# EasyEDA Pro project easyServo_easyEDA_PRO.epro

# Schematic Schematic3
Board Name: Board3; Create Date: 2025-09-12; Page Name: P1; Project Name: projeto2; Schematic Name: Schematic3; Update Date: 2025-10-06; Company: Bagre Corporation; Page Size: A4; Version: V1.0
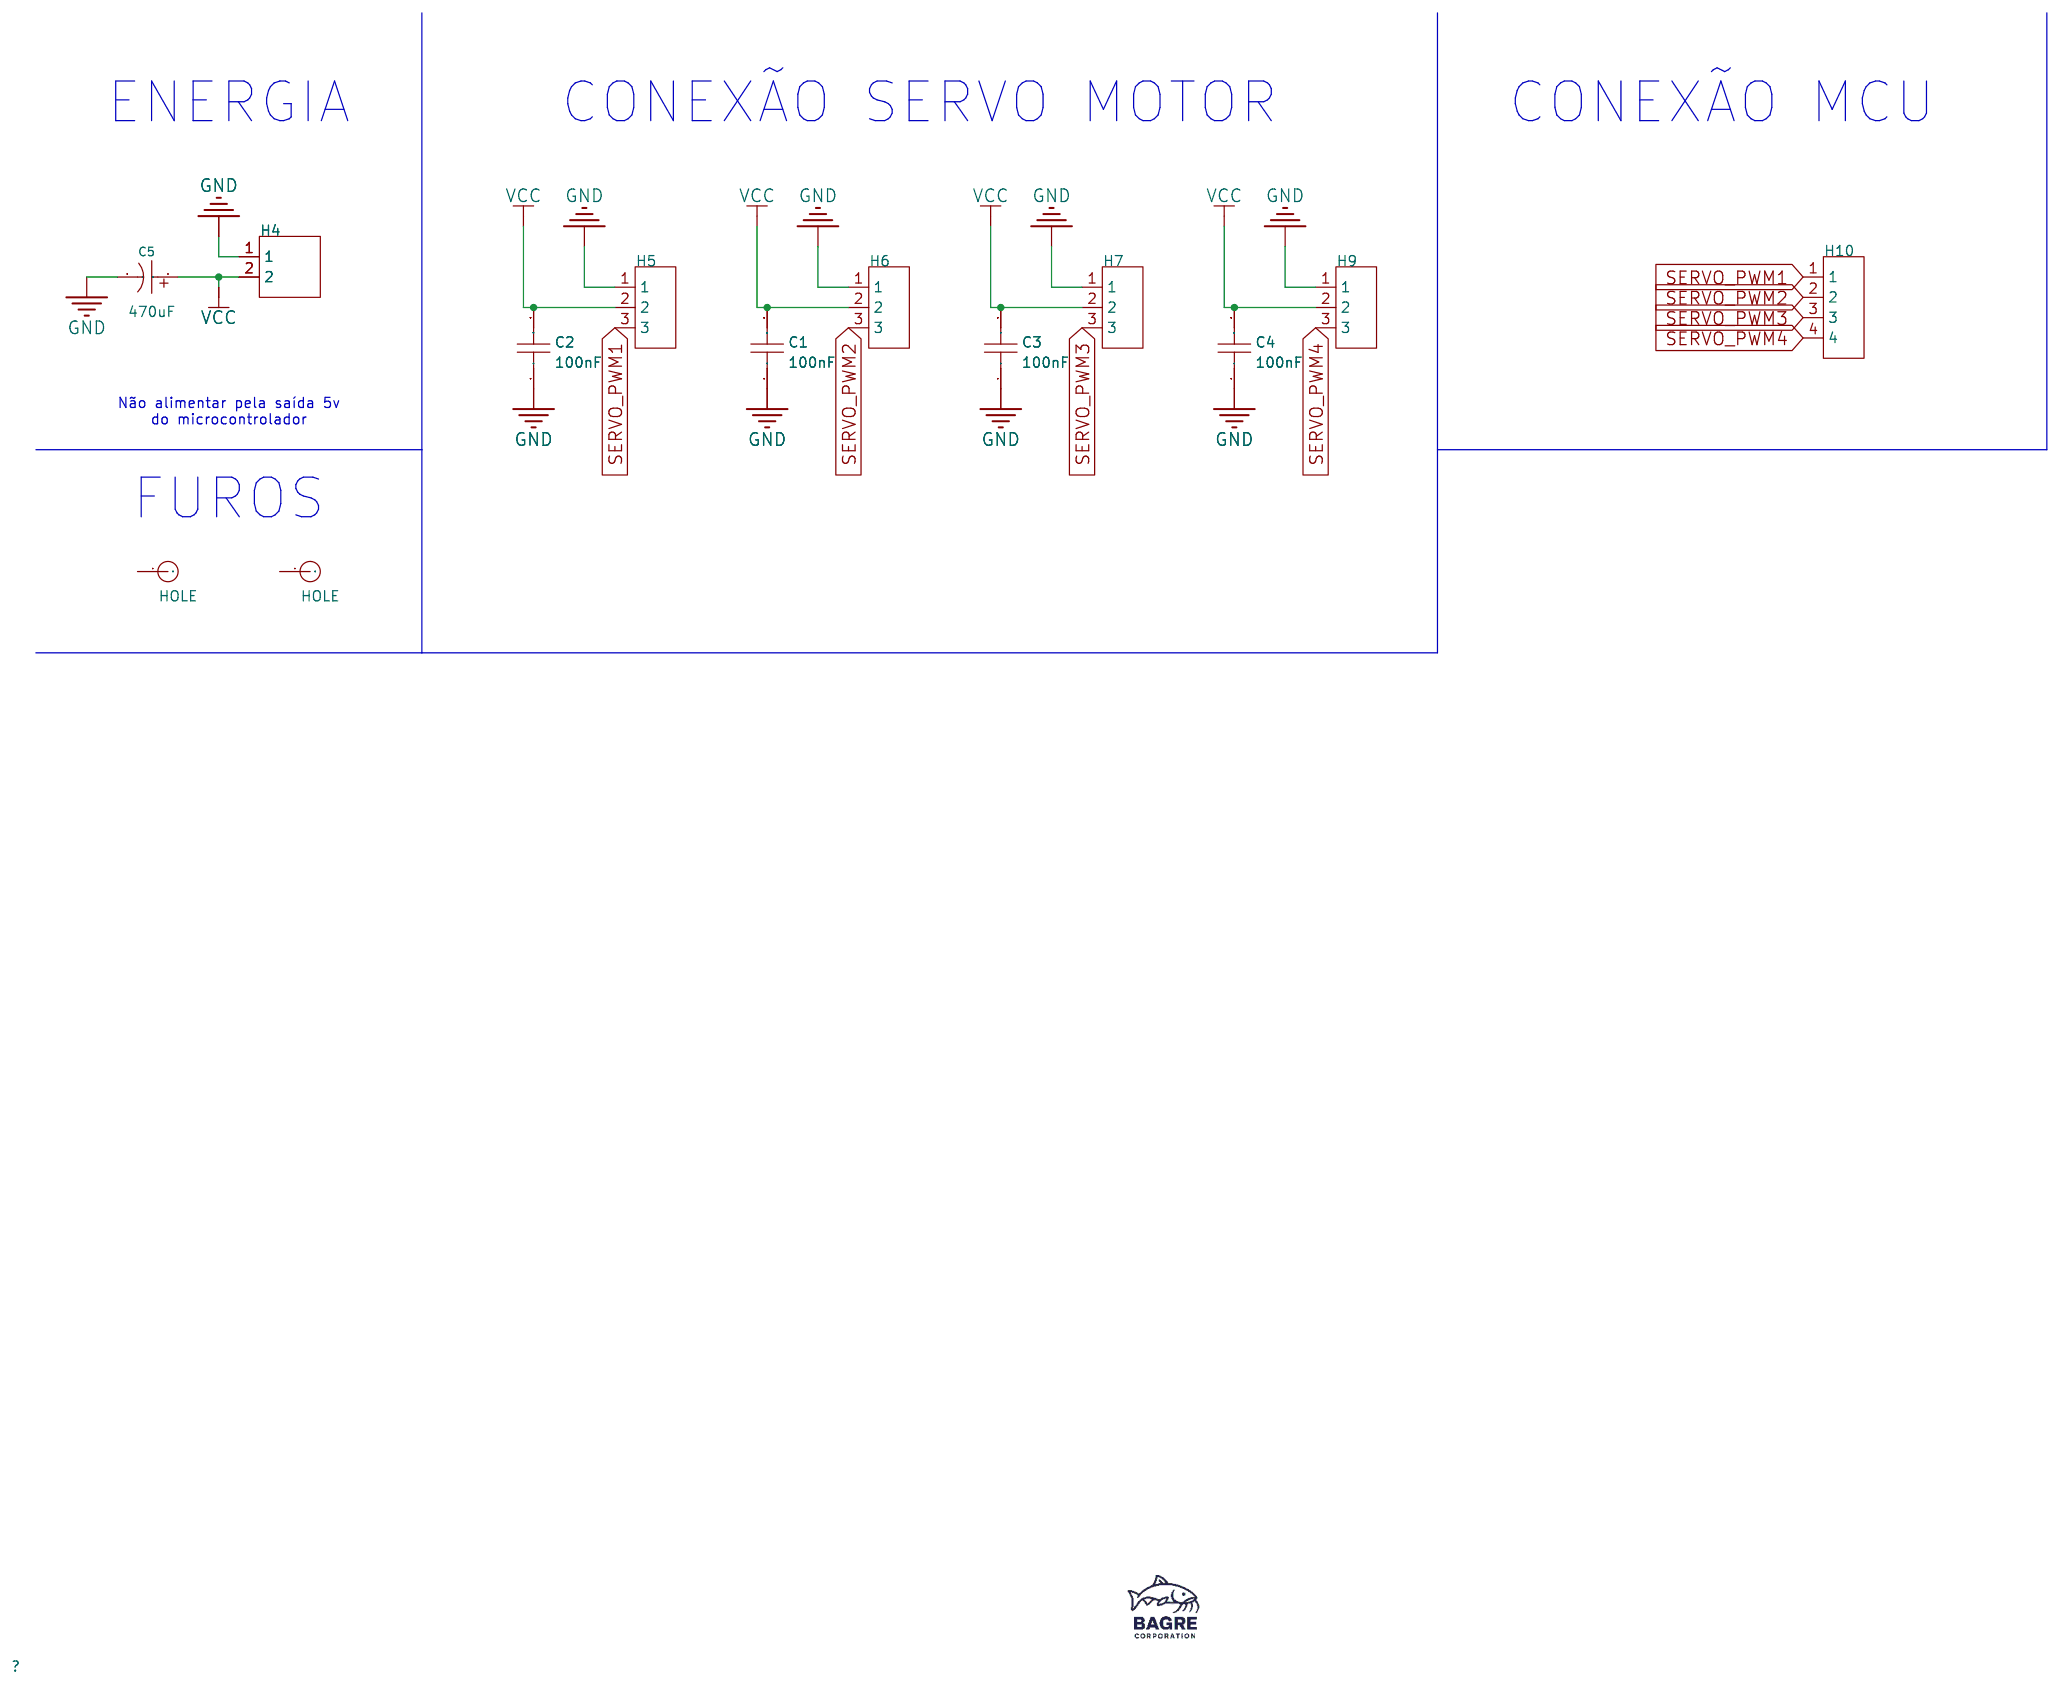
[diagram p0: schematic sheet]

## Parts
C1  100nF  [C1206]
C2  100nF  [C1206]
C3  100nF  [C1206]
C4  100nF  [C1206]
C5  470uF  [CAP-TH_BD6.3-P2.50-D1.0-FD]
H4  -  [HDR-TH_2P-P2.54-V-M-1]
H5  -  [HDR-TH_3P-P2.54-V-M]
H6  -  [HDR-TH_3P-P2.54-V-M]
H7  -  [HDR-TH_3P-P2.54-V-M]
H9  -  [HDR-TH_3P-P2.54-V-M]
H10  -  [HDR-TH_4P-P2.54-V-M]
J1  HOLE  [M2 Mounting Hole - Conductive]
J2  HOLE  [M2 Mounting Hole - Conductive]

## Library data of the parts
C1-C4 = CGJ5L3X7R2D104K160AA: Capacitance: Tolerance:±10% Tolerance:±10% Voltage Rated: Temperature Coefficient:; LCSC Part Name: 100nF ±10% 200V; Supplier Part: C3883443; Manufacturer: TDK; Supplier Footprint: 1206; JLCPCB Part Class: Extended Part; Datasheet: https://atta.szlcsc.com/upload/public/pdf/source/20200407/C508866_6C2FBB2ED8803457DDD31F7C87FB92E8.pdf; Supplier: LCSC; Tolerance: ±10%
C5 = ERR1CM471E14OT: Capacitance: Tolerance:±20% Tolerance:±20% Rated Voltage: Lead Spacing: φD: L: Lifetime @ Temp:2000hrs@105℃; LCSC Part Name: 470uF ±20% 16V; Supplier Part: C106619; Manufacturer: AISHI(艾华集团); Supplier Footprint: 插件,D6.3xL14mm; JLCPCB Part Class: Extended Part; Datasheet: https://atta.szlcsc.com/upload/public/pdf/source/20190702/C401591_1676EF45BC9A88BD1D6B22BBAE3913C7.pdf; Supplier: LCSC; Tolerance: ±20%; Lifetime @ Temp: 2000hrs@105℃
H4 = HDR-M_2.54_1x2P: Supplier Footprint: Through
H5-H7 H9 = HDR-M_2.54_1x3P: Supplier Footprint: Through
H10 = HDR-M_2.54_1x4P: Supplier Footprint: Through
J1 J2 = HOLE

## Nets
GND: C1.1 C2.1 C3.1 C4.1 C5.2 H4.1 H5.1 H6.1 H7.1 H9.1
VCC: C1.2 C2.2 C3.2 C4.2 C5.1 H4.2 H5.2 H6.2 H7.2 H9.2
SERVO_PWM1: H5.3 H10.1
SERVO_PWM2: H6.3 H10.2
SERVO_PWM3: H7.3 H10.3
SERVO_PWM4: H9.3 H10.4

Not connected (* = marked no-connect by the designer): J1 1(P1); J2 1(P1)

## Notes on the sheet
- ENERGIA
- CONEXÃO SERVO MOTOR
- CONEXÃO MCU
- Não alimentar pela saída 5v
  do microcontrolador
- FUROS

# Board PCB6
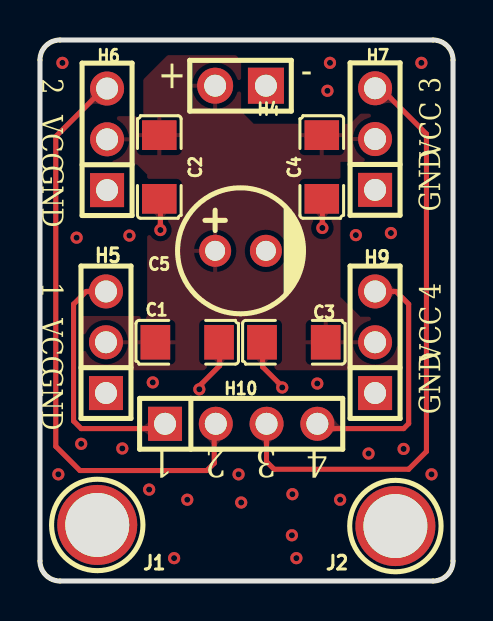
[diagram p1: board, top side]
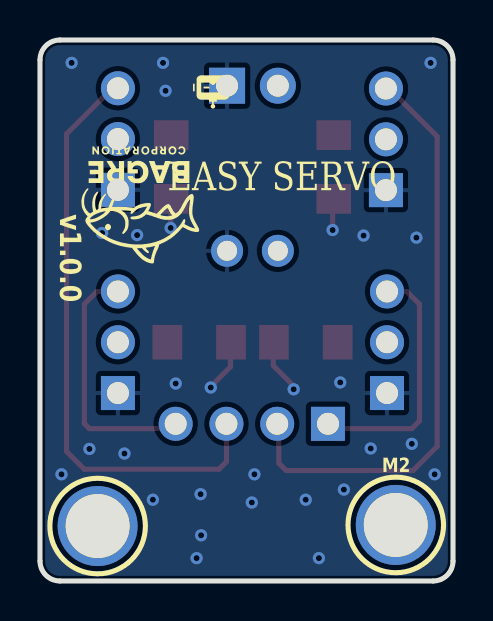
[diagram p2: board, bottom side, seen from below]

Outline 20.66 x 27.05 mm; copper layers: Top Layer, Bottom Layer. Coordinates in mm from the lower left corner of the outline.
Outline path: 0,26.05 0,1 arc(0.29,0.29) 1,0 19.66,0 arc(20.37,0.29) 20.66,1 20.66,26.05 arc(20.37,26.76) 19.66,27.05 1,27.05 arc(0.29,26.76) 0,26.05
Stack: Top Layer 0.035mm / Dielectric1 1.51mm FR4 er 4.5 / Bottom Layer 0.035mm

## Design rules (mm)
template: Custom Config
spacing copperThickness1oz (default): track to track 0.102, other pairs 0.152 to 0.3
spacing copperThickness2oz: track to track 0.203, other pairs 0.152 to 0.3
track width copperThickness1oz (default): min 0.127, default 0.254, max 2.54
track width copperThickness2oz: min 0.203, default 0.254, max 2.54
differential pair differentialPair (default): width min 0.127, default 0.254, max 2.54; gap min 0.152, default 0.152
via viaSize (default): diameter min 0.5, default 0.61, max 10; hole min 0.3, default 0.305, max 6.3

## Placement (name value [footprint] x y rotation side)
C1  100nF  [C1206]  7.37 11.94 180 top
C2  100nF  [C1206]  5.97 20.7 90 top
C3  100nF  [C1206]  12.7 11.94 0 top
C4  100nF  [C1206]  14.1 20.7 90 top
C5  470uF  [CAP-TH_BD6.3-P2.50-D1.0-FD]  10.03 16.51 0 top
H4  -  [HDR-TH_2P-P2.54-V-M-1]  10.03 24.77 180 top
H5  -  [HDR-TH_3P-P2.54-V-M]  3.3 11.94 90 top
H6  -  [HDR-TH_3P-P2.54-V-M]  3.36 22.08 90 top
H7  -  [HDR-TH_3P-P2.54-V-M]  16.76 22.1 90 top
H9  -  [HDR-TH_3P-P2.54-V-M]  16.76 11.94 90 top
H10  -  [HDR-TH_4P-P2.54-V-M]  10.07 7.86 0 top
J1  HOLE  [M2 Mounting Hole - Conductive]  2.86 2.93 0 top
J2  HOLE  [M2 Mounting Hole - Conductive]  17.78 2.87 0 top

## Footprints (pads in the part's own frame, mm; a bottom-side part is the same pattern mirrored in y, then rotated)
C1206
  rect 1.485x1.728 smd: 1(-1.593,0) 2(1.593,0)
CAP-TH_BD6.3-P2.50-D1.0-FD
  round 1.6 hole 1: 1(-1.27,0) 2(1.27,0)
HDR-TH_2P-P2.54-V-M-1
  rect 1.8x1.8 hole 1.1: 1(-1.27,0)
  round 1.8 hole 1.1: 2(1.27,0)
HDR-TH_3P-P2.54-V-M
  rect 1.7x1.7 hole 1.1: 1(-2.54,0)
  round 1.7 hole 1.1: 2(0,0) 3(2.54,0)
HDR-TH_4P-P2.54-V-M
  rect 1.7x1.7 hole 1.1: 1(-3.81,0)
  round 1.7 hole 1.1: 2(-1.27,0) 3(1.27,0) 4(3.81,0)
M2 Mounting Hole - Conductive
  round 4 hole 3.2x2.2: 1(0,-0.127)

## Nets
As in the schematic.

Pads without a net: J1 1; J2 1

## Via types
v1: diameter 0.61, hole 0.305, Top Layer to Bottom Layer, 29 vias

## Routing (per net, layer and track width the routed paths; a pad name or vN(x,y) marks a point on that pad's centre or on a via; arc(x,y) is an arc through that point)
GND: length 8.7
  Top Layer w0.254: v1(14.13,17.65) 14.13,19.36 ; v1(6.02,17.55) 6.02,19.08 6,19.11 ; 11.14,11.94 11.14,10.71 12.12,9.72 v1(12.12,9.67) ; v1(7.97,9.58) 7.97,9.75 8.99,10.77 8.99,11.94
  vias: v1(0.92,5.33) v1(1.12,25.91) v1(1.83,17.17) v1(2.06,6.86) v1(4.12,6.63) v1(4.47,17.27) v1(5.46,4.57) v1(5.64,9.93) v1(6.71,1.14) v1(7.37,4.06) v1(9.94,5.33) v1(10.07,3.92) v1(12.63,4.34) v1(12.6,2.29) v1(12.83,1.14) v1(13.87,9.87) v1(14.38,24.51) v1(14.51,25.91) v1(15.02,4.06) v1(15.8,17.3) v1(16.44,6.37) v1(17.56,17.4) v1(18.19,6.6) v1(19.08,25.91) v1(19.59,5.33)
SERVO_PWM1: length 12.6
  Top Layer w0.254: 3.33,14.48 2.32,14.48 1.68,13.84 1.68,8 2.06,7.62 6,7.62 6.25,7.87
SERVO_PWM2: length 29.8
  Top Layer w0.254: 8.79,8 8.72,7.93 8.72,5.89 8.35,5.52 2,5.52 0.79,6.73 0.79,22.22 3.33,24.77
SERVO_PWM3: length 30
  Top Layer w0.254: 16.79,24.89 19.33,22.35 19.33,6.48 18.44,5.59 11.71,5.59 11.33,5.97 11.33,8
SERVO_PWM4: length 12.7
  Top Layer w0.254: 13.87,7.87 14.13,7.62 18.19,7.62 18.44,7.87 18.44,13.84 17.81,14.48 16.79,14.48

## Copper pours and planes (outline as drawn; the poured copper is in the pictures)
GND on Bottom Layer: 20.48,0.13 0.16,0.13 0.16,26.92 20.48,26.92
VCC on Top Layer: 18.04,10.54 2.13,10.54 2.08,13.25 5.36,13.25 5.36,20.32 4.86,20.83 2.57,20.83 2.32,21.08 2.32,22.86 2.7,23.24 5.17,23.24 5.17,25.08 6.38,26.29 9.81,26.29 10.06,26.03 10.06,23.5 10.7,22.86 15.52,22.86 16.03,23.37 17.17,23.37 17.94,22.61 17.94,21.25 17.64,20.95 15.04,20.95 15.04,14.2 16.03,13.21 17.7,13.21 18.04,12.87

Small or netless copper shapes (teardrops, artwork), in the pictures only: 16 on Top Layer

## Text on the board
Bottom Silkscreen Layer: EASY SERVO | v1.0.0 | M2
Top Silkscreen Layer: GND | 3 | VCC | 4 | 2 | 1 | + | -
